# Altium schematic sheet REL_IF.SchDoc
size A4; SheetNumber: 5; SheetTotal: 13
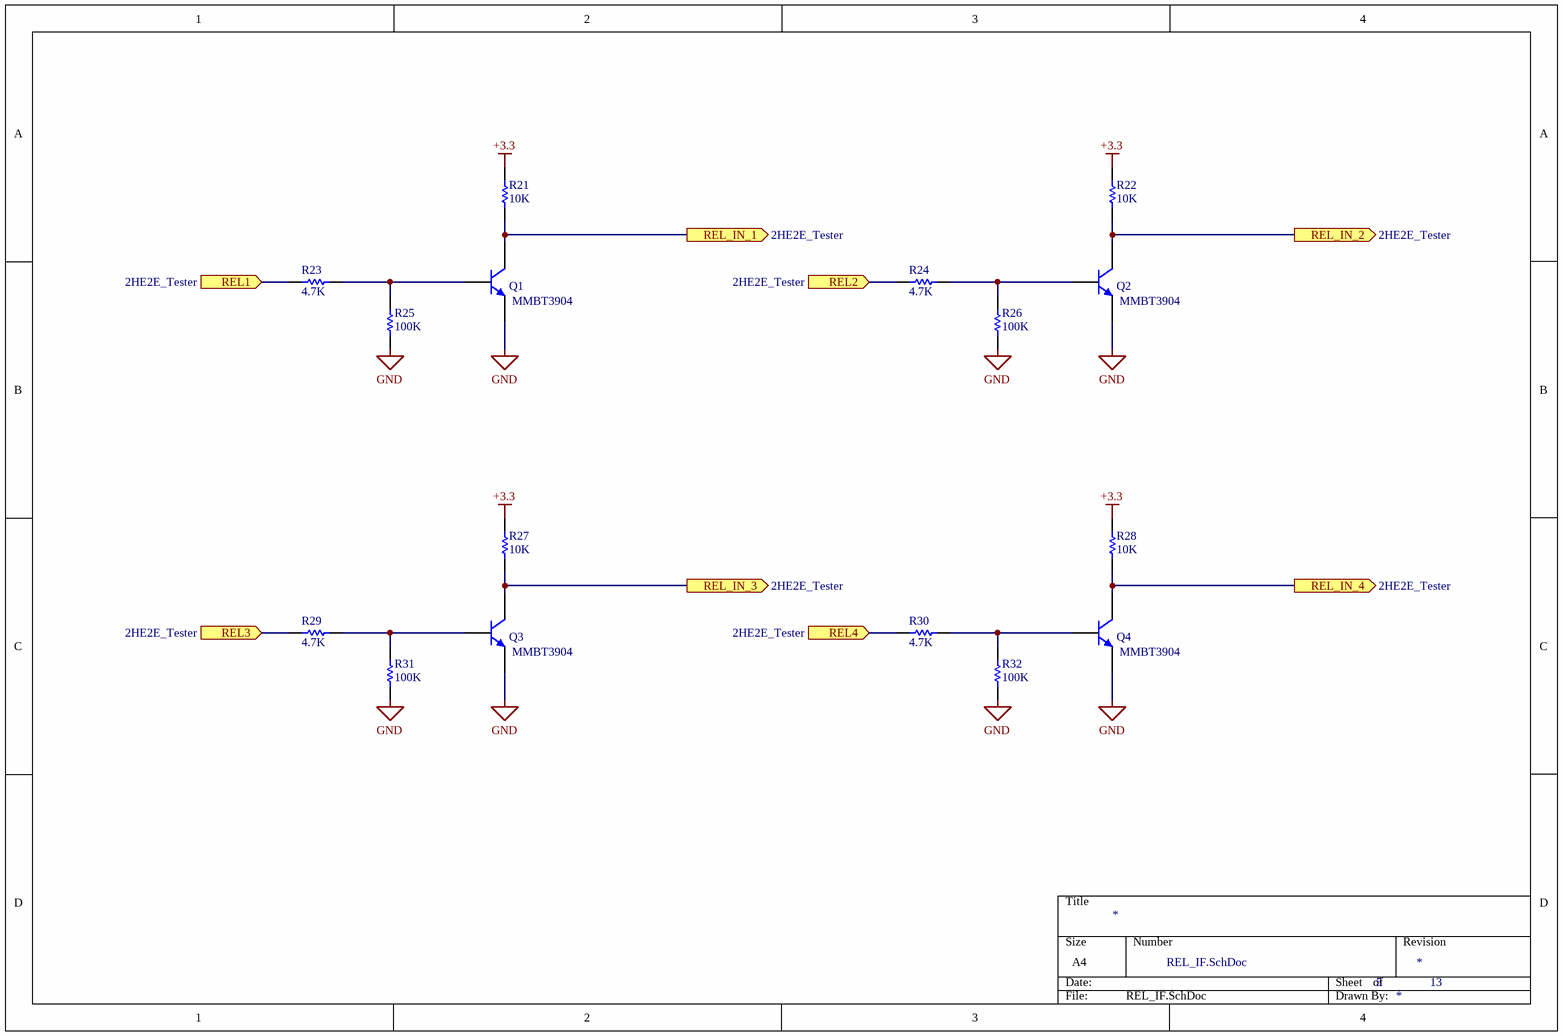
[diagram p0: REL_IF.SchDoc]

## Parts
Q1  MMBT3904  [SOT23 BSR14]
Q2  MMBT3904  [SOT23 BSR14]
Q3  MMBT3904  [SOT23 BSR14]
Q4  MMBT3904  [SOT23 BSR14]
R21  value 10K  [0603M]  (hidden comment: Resistor)
R22  value 10K  [0603M]  (hidden comment: Resistor)
R23  value 4.7K  [0603M]  (hidden comment: Resistor)
R24  value 4.7K  [0603M]  (hidden comment: Resistor)
R25  value 100K  [0603M]  (hidden comment: Resistor)
R26  value 100K  [0603M]  (hidden comment: Resistor)
R27  value 10K  [0603M]  (hidden comment: Resistor)
R28  value 10K  [0603M]  (hidden comment: Resistor)
R29  value 4.7K  [0603M]  (hidden comment: Resistor)
R30  value 4.7K  [0603M]  (hidden comment: Resistor)
R31  value 100K  [0603M]  (hidden comment: Resistor)
R32  value 100K  [0603M]  (hidden comment: Resistor)

## Ports
REL1 (in, see 2HE2E_Tester), REL2 (in, see 2HE2E_Tester), REL3 (in, see 2HE2E_Tester), REL4 (in, see 2HE2E_Tester), REL_IN_1 (out, see 2HE2E_Tester), REL_IN_2 (out, see 2HE2E_Tester), REL_IN_3 (out, see 2HE2E_Tester), REL_IN_4 (out, see 2HE2E_Tester)

## Nets
+3.3: R21.1 R22.1 R27.1 R28.1
GND: Q1.3(E) Q2.3(E) Q3.3(E) Q4.3(E) R25.2 R26.2 R31.2 R32.2
REL1: R23.1 ; port REL1
REL2: R24.1 ; port REL2
REL3: R29.1 ; port REL3
REL4: R30.1 ; port REL4
REL_IN_1: Q1.1(C) R21.2 ; port REL_IN_1
REL_IN_2: Q2.1(C) R22.2 ; port REL_IN_2
REL_IN_3: Q3.1(C) R27.2 ; port REL_IN_3
REL_IN_4: Q4.1(C) R28.2 ; port REL_IN_4
NetQ1_2: Q1.2(B) R23.2 R25.1
NetQ2_2: Q2.2(B) R24.2 R26.1
NetQ3_2: Q3.2(B) R29.2 R31.1
NetQ4_2: Q4.2(B) R30.2 R32.1

## Notes on the sheet
- Title
- Size:
- Date:
- A4
- Number:
- Time:
- Revision:
- Sheet
- of
- File:

## Library data of the parts
Q1-Q4 = Transistor NPN: NPN Bipolar Transistor